# Altium schematic sheet USB_HUB.SchDoc
size A4; SheetNumber: 4; SheetTotal: 7
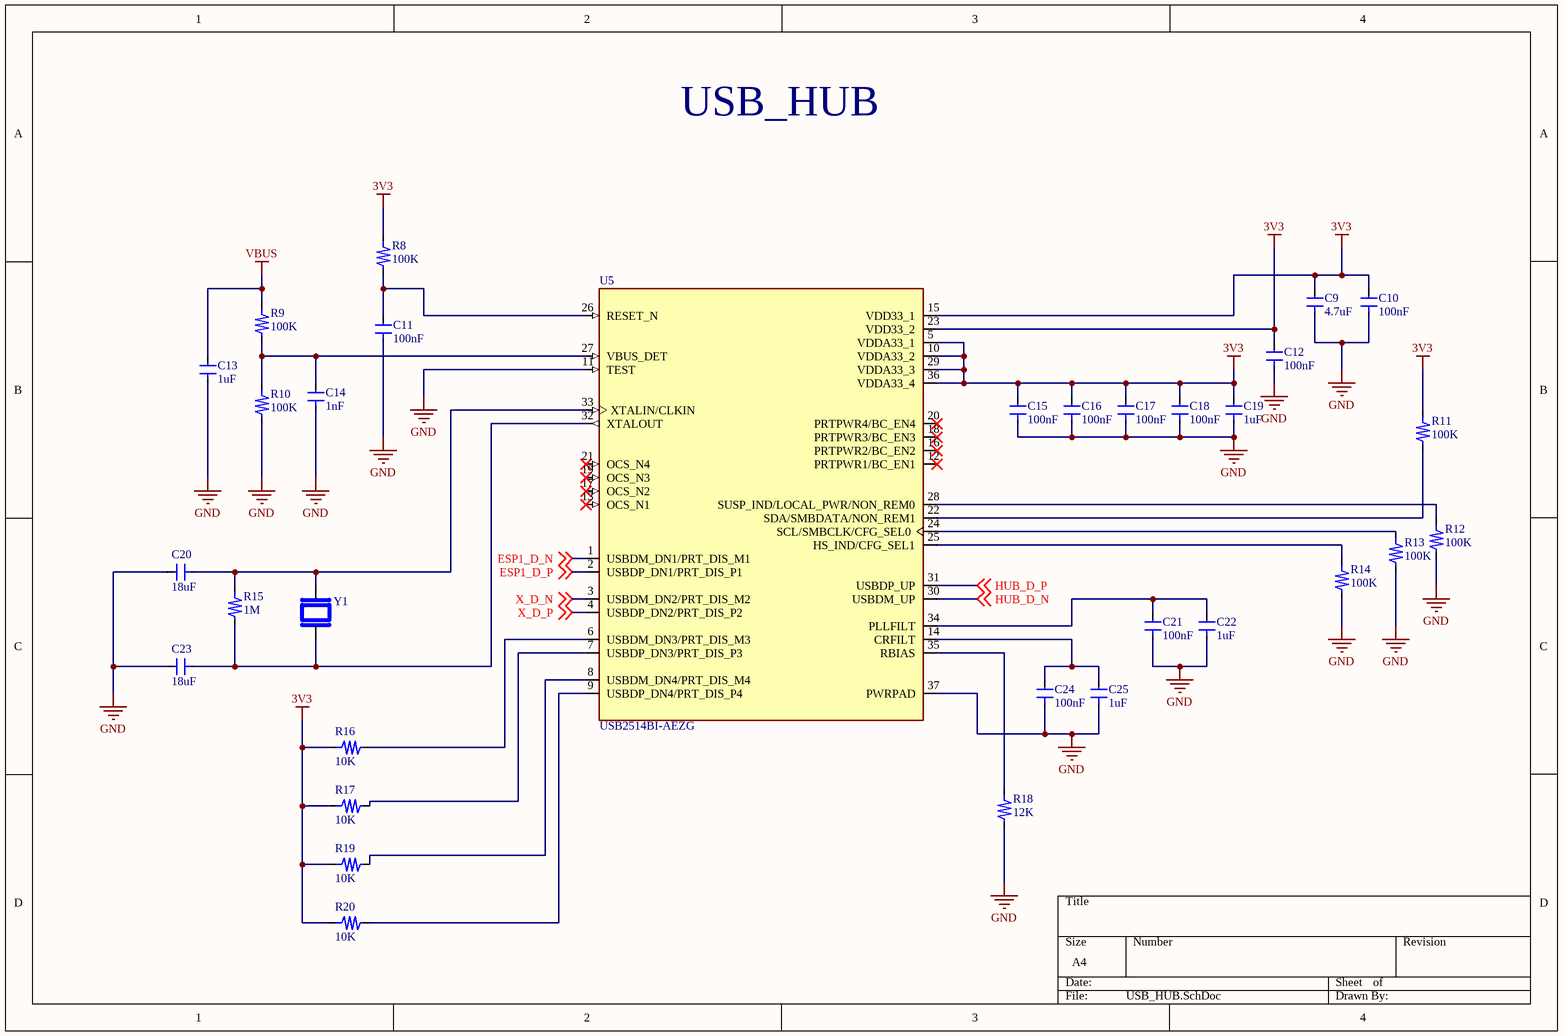
[diagram p0: USB_HUB.SchDoc]

## Parts
C9  4.7uF  [CAP 0603]
C10  100nF  [CAP 0603]
C11  100nF  [CAP 0603]
C12  100nF  [CAP 0603]
C13  1uF  [CAP 0603]
C14  1nF  [CAP 0603]
C15  100nF  [CAP 0603]
C16  100nF  [CAP 0603]
C17  100nF  [CAP 0603]
C18  100nF  [CAP 0603]
C19  1uF  [CAP 0603]
C20  18uF  [CAP 0603]
C21  100nF  [CAP 0603]
C22  1uF  [CAP 0603]
C23  18uF  [CAP 0603]
C24  100nF  [CAP 0603]
C25  1uF  [CAP 0603]
R8  100K  [RES 0603]
R9  100K  [RES 0603]
R10  100K  [RES 0603]
R11  100K  [RES 0603]
R12  100K  [RES 0603]
R13  100K  [RES 0603]
R14  100K  [RES 0603]
R15  1M  [RES 0603]
R16  10K  [RES 0603]
R17  10K  [RES 0603]
R18  12K  [RES 0603]
R19  10K  [RES 0603]
R20  10K  [RES 0603]
U5  USB2514BI-AEZG  [QFN50P600X600X100-37N]
Y1  ABLS-24.000MHZ-B4-T  [XTAL_ABLS-24.000MHZ-B4-T]  (value not drawn)

## Nets
3V3: C9.2 C10.2 C12.2 C15.2 C16.2 C17.2 C18.2 C19.2 R8.1 R11.1 R16.1 R17.1 R19.1 R20.1 U5.5(VDDA33_1) U5.10(VDDA33_2) U5.15(VDD33_1) U5.23(VDD33_2) U5.29(VDDA33_3) U5.36(VDDA33_4)
GND: C9.1 C10.1 C11.1 C12.1 C13.1 C14.1 C15.1 C16.1 C17.1 C18.1 C19.1 C20.2 C21.1 C22.1 C23.2 C24.1 C25.1 R10.2 R12.2 R13.2 R14.2 R18.2 U5.11(TEST) U5.37(PWRPAD)
VBUS: C13.2 R9.1
ESP1_D_N: U5.1(USBDM_DN1/PRT_DIS_M1) ; off-sheet ESP1_D_N
ESP1_D_P: U5.2(USBDP_DN1/PRT_DIS_P1) ; off-sheet ESP1_D_P
HUB_D_N: U5.30(USBDM_UP) ; off-sheet HUB_D_N
HUB_D_P: U5.31(USBDP_UP) ; off-sheet HUB_D_P
X_D_N: U5.3(USBDM_DN2/PRT_DIS_M2) ; off-sheet X_D_N
X_D_P: U5.4(USBDP_DN2/PRT_DIS_P2) ; off-sheet X_D_P
NetC11_2: C11.2 R8.2 U5.26(RESET_N)
NetC14_2: C14.2 R9.2 R10.1 U5.27(VBUS_DET)
NetC20_1: C20.1 R15.1 U5.33(XTALIN/CLKIN) Y1.2
NetC21_2: C21.2 C22.2 U5.34(PLLFILT)
NetC23_1: C23.1 R15.2 U5.32(XTALOUT) Y1.1
NetC24_2: C24.2 C25.2 U5.14(CRFILT)
NetR11_2: R11.2 U5.22(SDA/SMBDATA/NON_REM1)
NetR12_1: R12.1 U5.28(SUSP_IND/LOCAL_PWR/NON_REM0)
NetR13_1: R13.1 U5.24(SCL/SMBCLK/CFG_SEL0)
NetR14_1: R14.1 U5.25(HS_IND/CFG_SEL1)
NetR16_2: R16.2 U5.6(USBDM_DN3/PRT_DIS_M3)
NetR17_2: R17.2 U5.7(USBDP_DN3/PRT_DIS_P3)
NetR18_1: R18.1 U5.35(RBIAS)
NetR19_2: R19.2 U5.8(USBDM_DN4/PRT_DIS_M4)
NetR20_2: R20.2 U5.9(USBDP_DN4/PRT_DIS_P4)

Not connected (* = marked no-connect by the designer): U5 12(PRTPWR1/BC_EN1)* 13(OCS_N1)* 16(PRTPWR2/BC_EN2)* 17(OCS_N2)* 18(PRTPWR3/BC_EN3)* 19(OCS_N3)* 20(PRTPWR4/BC_EN4)* 21(OCS_N4)*

## Notes on the sheet
- USB_HUB

## Library data of the parts
C9 = Capasitor: Part Number: CL10A475KL8NRNC; Manufacture: Samsung Electro-Mechanics; Footprint size: 0603; ComponentLink1Description: New link; ComponentLink1URL: *; Supplier: LCSC; Supplier Part Number: C307467; Link: https://www.lcsc.com/product-detail/C307467.html?spm=wm.fly.bg.0.xh&lcsc_vid=RFYMBlMFQAQLUVJeFVJZXwVeRFYIAgBXEVkPUlxRRVUxVlNRQFNWU1xXQ1FYVTsOAxUeFF5JWBYZEEoKFBINSQcJGk4NBhADEA4cHktXRlVcSQwSGg0%3D
C10-C12 C15-C18 C21 C24 = Capasitor: Part Number: CC0603JRX7R9BB104; Manufacture: YAGEO; Footprint size: 0603; ComponentLink1Description: New link; ComponentLink1URL: *; Supplier: LCSC; Supplier Part Number: C91183; Link: https://www.lcsc.com/product-detail/C91183.html?spm=wm.fly.bg.0.xh&lcsc_vid=RFYMBlMFQAQLUVJeFVJZXwVeRFYIAgBXEVkPUlxRRVUxVlNRQFNZUlZTRldbXzsOAxUeFF5JWBYZEEoKFBINSQcJGk4NBhADEA4cHktXRlVcSQwSGg0%3D
C13 C19 C22 C25 = Capasitor: Part Number: CC0603JRX7R7BB105; Manufacture: YAGEO; Footprint size: 0603; ComponentLink1Description: New link; ComponentLink1URL: *; Supplier: LCSC; Supplier Part Number: C519560; Link: https://www.lcsc.com/product-detail/C519560.html?spm=wm.fly.bg.0.xh___wm.mly.mlk.28-0-4.ml&lcsc_vid=RFYMBlMFQAQLUVJeFVJZXwVeRFYIAgBXEVkPUlxRRVUxVlNRQFNYUlFWRVddVTsOAxUeFF5JWBYZEEoKFBINSQcJGk4dAgUUFAk%3D
C14 = Capasitor: Part Number: GRM1885C1H102JA01D; Manufacture: muRata; Footprint size: 0603; ComponentLink1Description: New link; ComponentLink1URL: *; Supplier: LCSC; Supplier Part Number: C77026; Link: https://www.lcsc.com/product-detail/C77026.html?spm=wm.fly.bg.0.xh&lcsc_vid=RFYMBlMFQAQLUVJeFVJZXwVeRFYIAgBXEVkPUlxRRVUxVlNRQFNZU1RTQVldUTsOAxUeFF5JWBYZEEoKFBINSQcJGk4NBhADEA4cHktXRlVcSQwSGg0%3D
C20 C23 = Capasitor: Part Number: CC0603FRNPO9BN180; Manufacture: YAGEO; Footprint size: 0603; ComponentLink1Description: New link; ComponentLink1URL: *; Supplier: LCSC; Supplier Part Number: C527046; Link: https://www.lcsc.com/product-detail/C527046.html?spm=wm.fly.bg.0.xh&lcsc_vid=RFYMBlMFQAQLUVJeFVJZXwVeRFYIAgBXEVkPUlxRRVUxVlNRQFNZUFBXRFNZUTsOAxUeFF5JWBYZEEoKFBINSQcJGk4NBhADEA4cHktXRlVcSQwSGg0%3D
R8-R14 = Resistor: Manufacture: FH; Part Number: RS-03K104JT; Footprint size: 0603; ComponentLink1Description: New link; ComponentLink1URL: *; Supplier: LCSC; Supplier Part Number: C73806; Link: https://www.lcsc.com/product-detail/C73806.html?spm=wm.fly.bg.0.xh___wm.mly.mlk.28-6-1.ml&lcsc_vid=RFYMBlMFQAQLUVJeFVJZXwVeRFYIAgBXEVkPUlxRRVUxVlNRQFNYUVZQRlheVDsOAxUeFF5JWBYZEEoKFBINSQcJGk4dAgUUFAk%3D
R15 = Resistor: Manufacture: FH; Part Number: RS-03K1004FT; Footprint size: 0603; ComponentLink1Description: New link; ComponentLink1URL: *; Supplier: LCSC; Supplier Part Number: C136593; Link: https://www.lcsc.com/product-detail/C136593.html?spm=wm.fly.bg.0.xh___wm.mly.mlk.28-6-1.ml&lcsc_vid=RFYMBlMFQAQLUVJeFVJZXwVeRFYIAgBXEVkPUlxRRVUxVlNRQFNYUVZQRlheVDsOAxUeFF5JWBYZEEoKFBINSQcJGk4dAgUUFAk%3D
R16 R17 R19 R20 = Resistor: Manufacture: FH; Part Number: RS-03K1002FT; Footprint size: 0603; ComponentLink1Description: New link; ComponentLink1URL: *; Supplier: LCSC; Supplier Part Number: C115324; Link: https://www.lcsc.com/product-detail/C115324.html?spm=wm.fly.bg.0.xh&lcsc_vid=RFYMBlMFQAQLUVJeFVJZXwVeRFYIAgBXEVkPUlxRRVUxVlNRQFNWVFZXQ1NWXjsOAxUeFF5JWBYZEEoKFBINSQcJGk4NBhADEA4cHktXRlhXSQwSGg0%3D
R18 = Resistor: Manufacture: FH; Part Number: RS-03K1202FT; Footprint size: 0603; ComponentLink1Description: New link; ComponentLink1URL: *; Supplier: LCSC; Supplier Part Number: C136587; Link: https://www.lcsc.com/product-detail/C136587.html?spm=wm.fly.bg.0.xh&lcsc_vid=RFYMBlMFQAQLUVJeFVJZXwVeRFYIAgBXEVkPUlxRRVUxVlNRQFNWV1FTRVJbVzsOAxUeFF5JWBYZEEoKFBINSQcJGk4NBhADEA4cHktXRlhXSQwSGg0%3D
U5 = USB2514BI-AEZG: USB Hub Controller USB 2.0 USB Interface 36-QFN (6x6); Manufacture: MICROCHIP; Part Number: USB2514BI-AEZG-TR; Footprint size: TQFN-36-EP(6x6); Supplier: LCSC; Supplier Part Number: C58940; Link: https://www.lcsc.com/product-detail/C58940.html?s_z=n_q_USB2514BI-AEZG-TR&spm=wm.fly.bg.0.xh&lcsc_vid=RFYMBlMFQAQLUVJeFVJZXwVeRFYIAgBXEVkPUlxRRVUxVlNRT1BZUlFWQ1JXUTsOAxUeFF5JWBYZEEoKFBINSQcJGk4eFQsCAgIaSgADAwAHC0slRVJXX1BIHxUDCw%3D%3D
Y1 = ABLS-24.000MHZ-B4-T: HC/49US (AT49) SMD LOW PROFILE CRYSTAL; Manufacture: ABRACON; Part Number: ABLS-24.000MHZ-B4-T; Footprint size: HC-49S-SMD; Supplier: LCSC; Supplier Part Number: C5122439; Link: https://www.lcsc.com/product-detail/C5122439.html?spm=wm.fly.bg.1.xh___wm.fly.tp.1.ml&lcsc_vid=RFYMBlMFQAQLUVJeFVJZXwVeRFYIAgBXEVkPUlxRRVUxVlNRQFNZUlZTRldbXzsOAxUeFF5JWBYZEEoKFBINSQcJGk4NBhADEA4cHktXRlVcSQwSGg0%3D